# EAGLE design ANIMA Sensor Breakout (EAGLE 5.11)

## Sheet 1 of 2
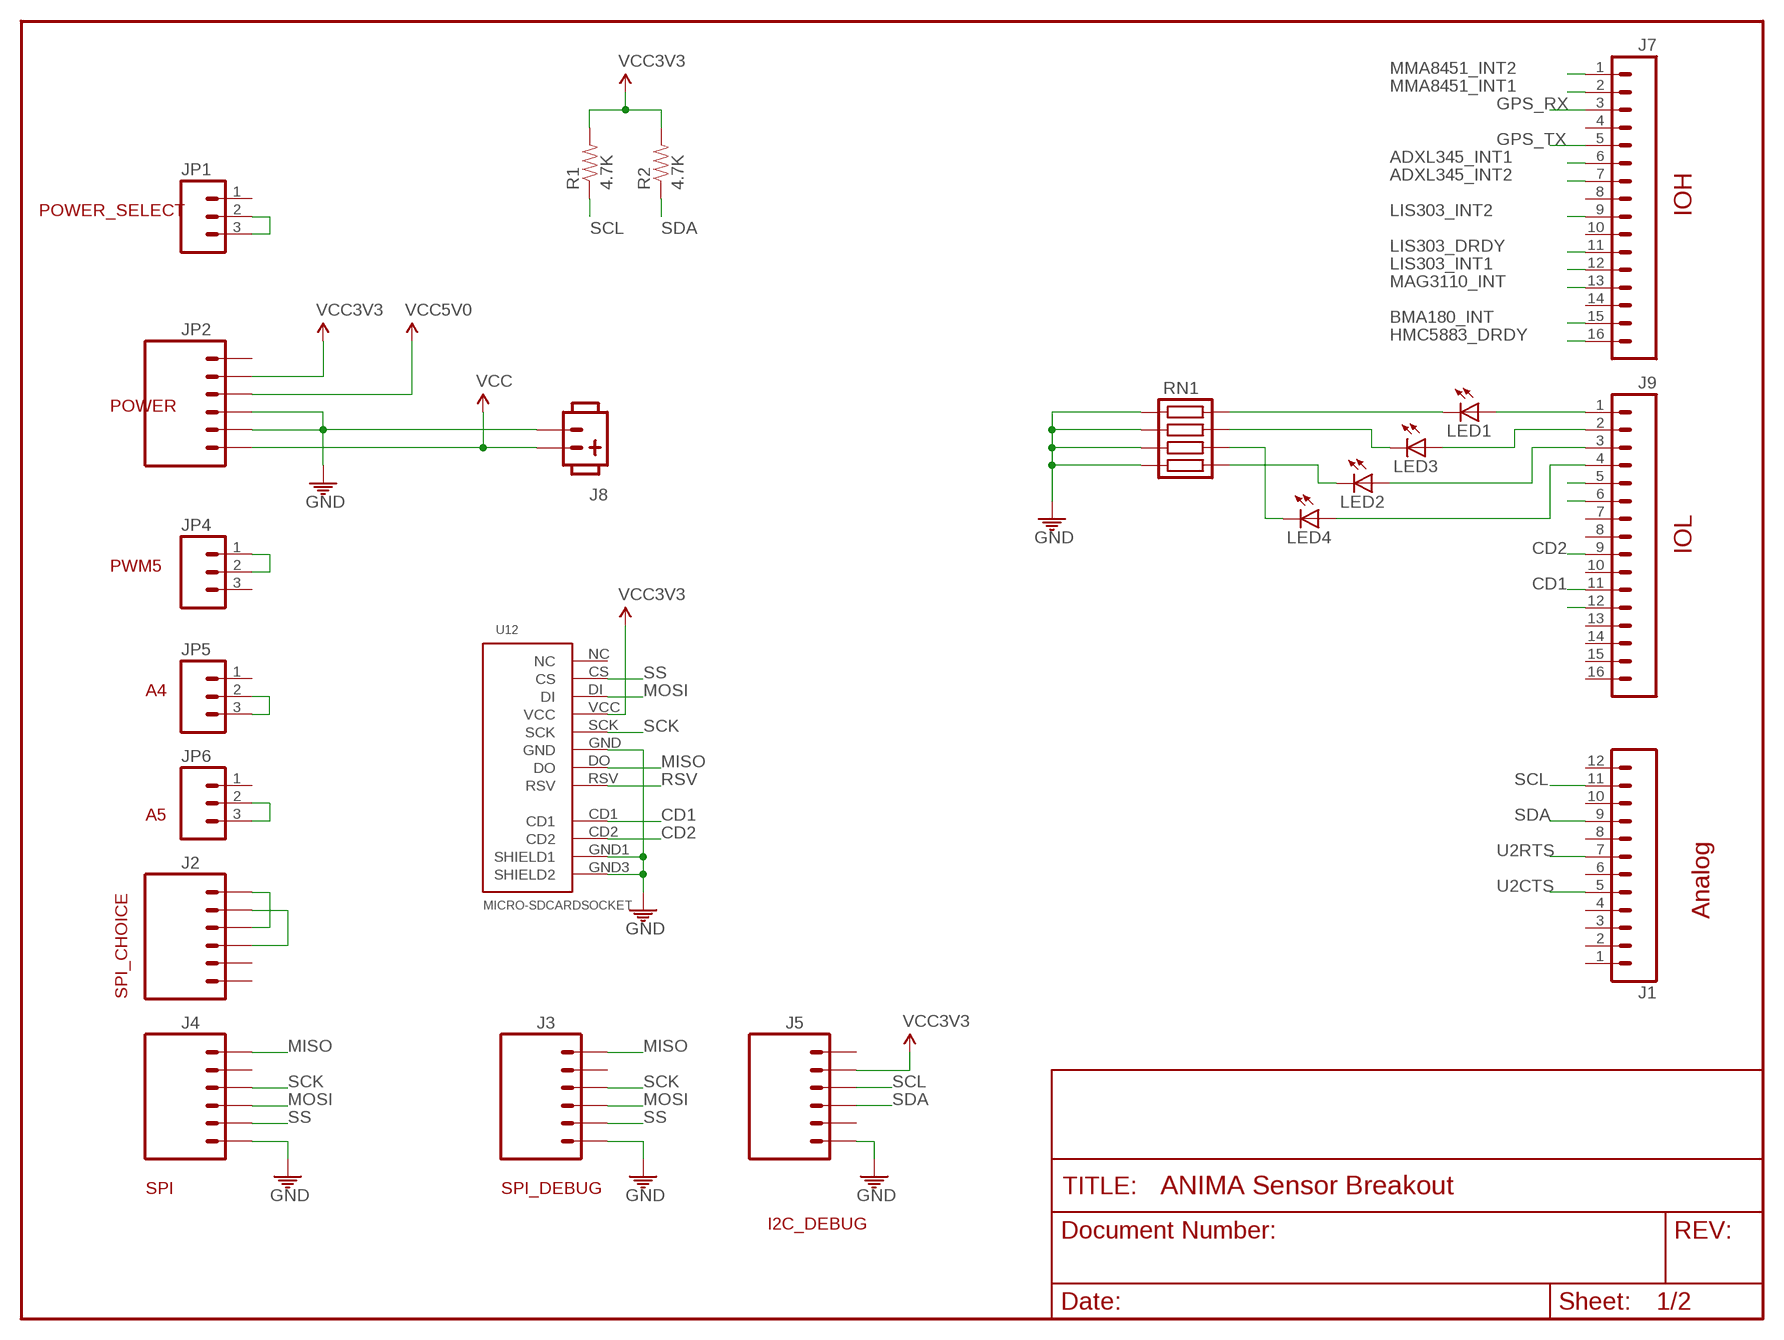
[diagram p0: schematic, sheet 1]

### Parts
J1  M12DUAL_ROW  [2X6]
J2  M06DUAL_ROW  [2X03]
J3  M06LOCK  [1X06_LOCK]
J4  M06DUAL_ROW  [2X03]
J5  M06LOCK  [1X06_LOCK]
J7  IOH  M16DUAL_ROW  [2X8]
J8  POW_CONNECTFEMALE-RA  [SOCKET-FEMALE_RA-3.96MM-2]
J9  IOL  M16DUAL_ROW  [2X8]
JP1  M03PTH  [1X03]
JP2  M06SIP  [1X06]
JP4  M03PTH  [1X03]
JP5  M03PTH  [1X03]
JP6  M03PTH  [1X03]
LED1  LED1206  [LED-1206]
LED2  LED1206  [LED-1206]
LED3  LED1206  [LED-1206]
LED4  LED1206  [LED-1206]
R1  4.7K  RESISTOR0805-RES  [0805]
R2  4.7K  RESISTOR0805-RES  [0805]
RN1  RESISTOR_ARRAY-4  [EXB-38V271JV]
U12  MICRO-SDCARDSOCKET  [MICRO-SD-SOCKET-PP]

### Nets
ADXL345_INT1: J7.6 ; also sheet 2
ADXL345_INT2: J7.7 ; also sheet 2
BMA180_INT: J7.15 ; also sheet 2
CD1: J9.11 U12.CD1
CD2: J9.9 U12.CD2
GND: J3.6 J4.6 J5.6 J8.2 JP2.4 JP2.5 RN1.P$1 RN1.P$2 RN1.P$3 RN1.P$4 U12.GND U12.GND1(SHIELD1) U12.GND3(SHIELD2) ; also sheet 2
GPS_RX: J7.3 ; also sheet 2
GPS_TX: J7.5 ; also sheet 2
HMC5883_DRDY: J7.16 ; also sheet 2
LIS303_DRDY: J7.11 ; also sheet 2
LIS303_INT1: J7.12 ; also sheet 2
LIS303_INT2: J7.9 ; also sheet 2
MAG3110_INT: J7.13 ; also sheet 2
MISO: J3.1 J4.1 U12.DO
MMA8451_INT1: J7.2 ; also sheet 2
MMA8451_INT2: J7.1 ; also sheet 2
MOSI: J3.4 J4.4 U12.DI
N$1: JP5.2 JP5.3
N$4: JP1.2 JP1.3
N$6: J2.1 J2.3
N$7: J2.2 J2.4
N$8: J9.1 LED1.A
N$9: J9.2 LED3.A
N$12: J9.3 LED2.A
N$13: J9.12
N$14: J9.4 LED4.A
N$15: J9.5
N$16: J9.6
N$17: LED4.C RN1.P$6
N$18: LED2.C RN1.P$5
N$20: LED3.C RN1.P$7
N$21: LED1.C RN1.P$8
N$89: JP4.1 JP4.2
N$91: JP6.2 JP6.3
RSV: U12.RSV
SCK: J3.3 J4.3 U12.SCK
SCL: J1.11 J5.3 R1.1 ; also sheet 2
SDA: J1.9 J5.4 R2.1 ; also sheet 2
SS: J3.5 J4.5 U12.CS
U2CTS: J1.5
U2RTS: J1.7
VCC: J8.1 JP2.6 ; also sheet 2
VCC3V3: J5.2 JP2.2 R1.2 R2.2 U12.VCC ; also sheet 2
VCC5V0: JP2.3
Unconnected: J1.1 J1.2 J1.3 J1.4 J1.6 J1.8 J1.10 J1.12 J2.5 J2.6 J3.2 J4.2 J5.1 J5.5 J7.4 J7.8 J7.10 J7.14 J9.7 J9.8 J9.10 J9.13 J9.14 J9.15 J9.16 JP1.1 JP2.1 JP4.3 JP5.1 JP6.1 U12.NC

### Notes on the sheet
- POWER_SELECT | IOH
- POWER
- IOL
- PWM5
- A4
- A5
- Analog
- SPI_CHOICE
- SPI | SPI_DEBUG
- I2C_DEBUG

## Sheet 2 of 2
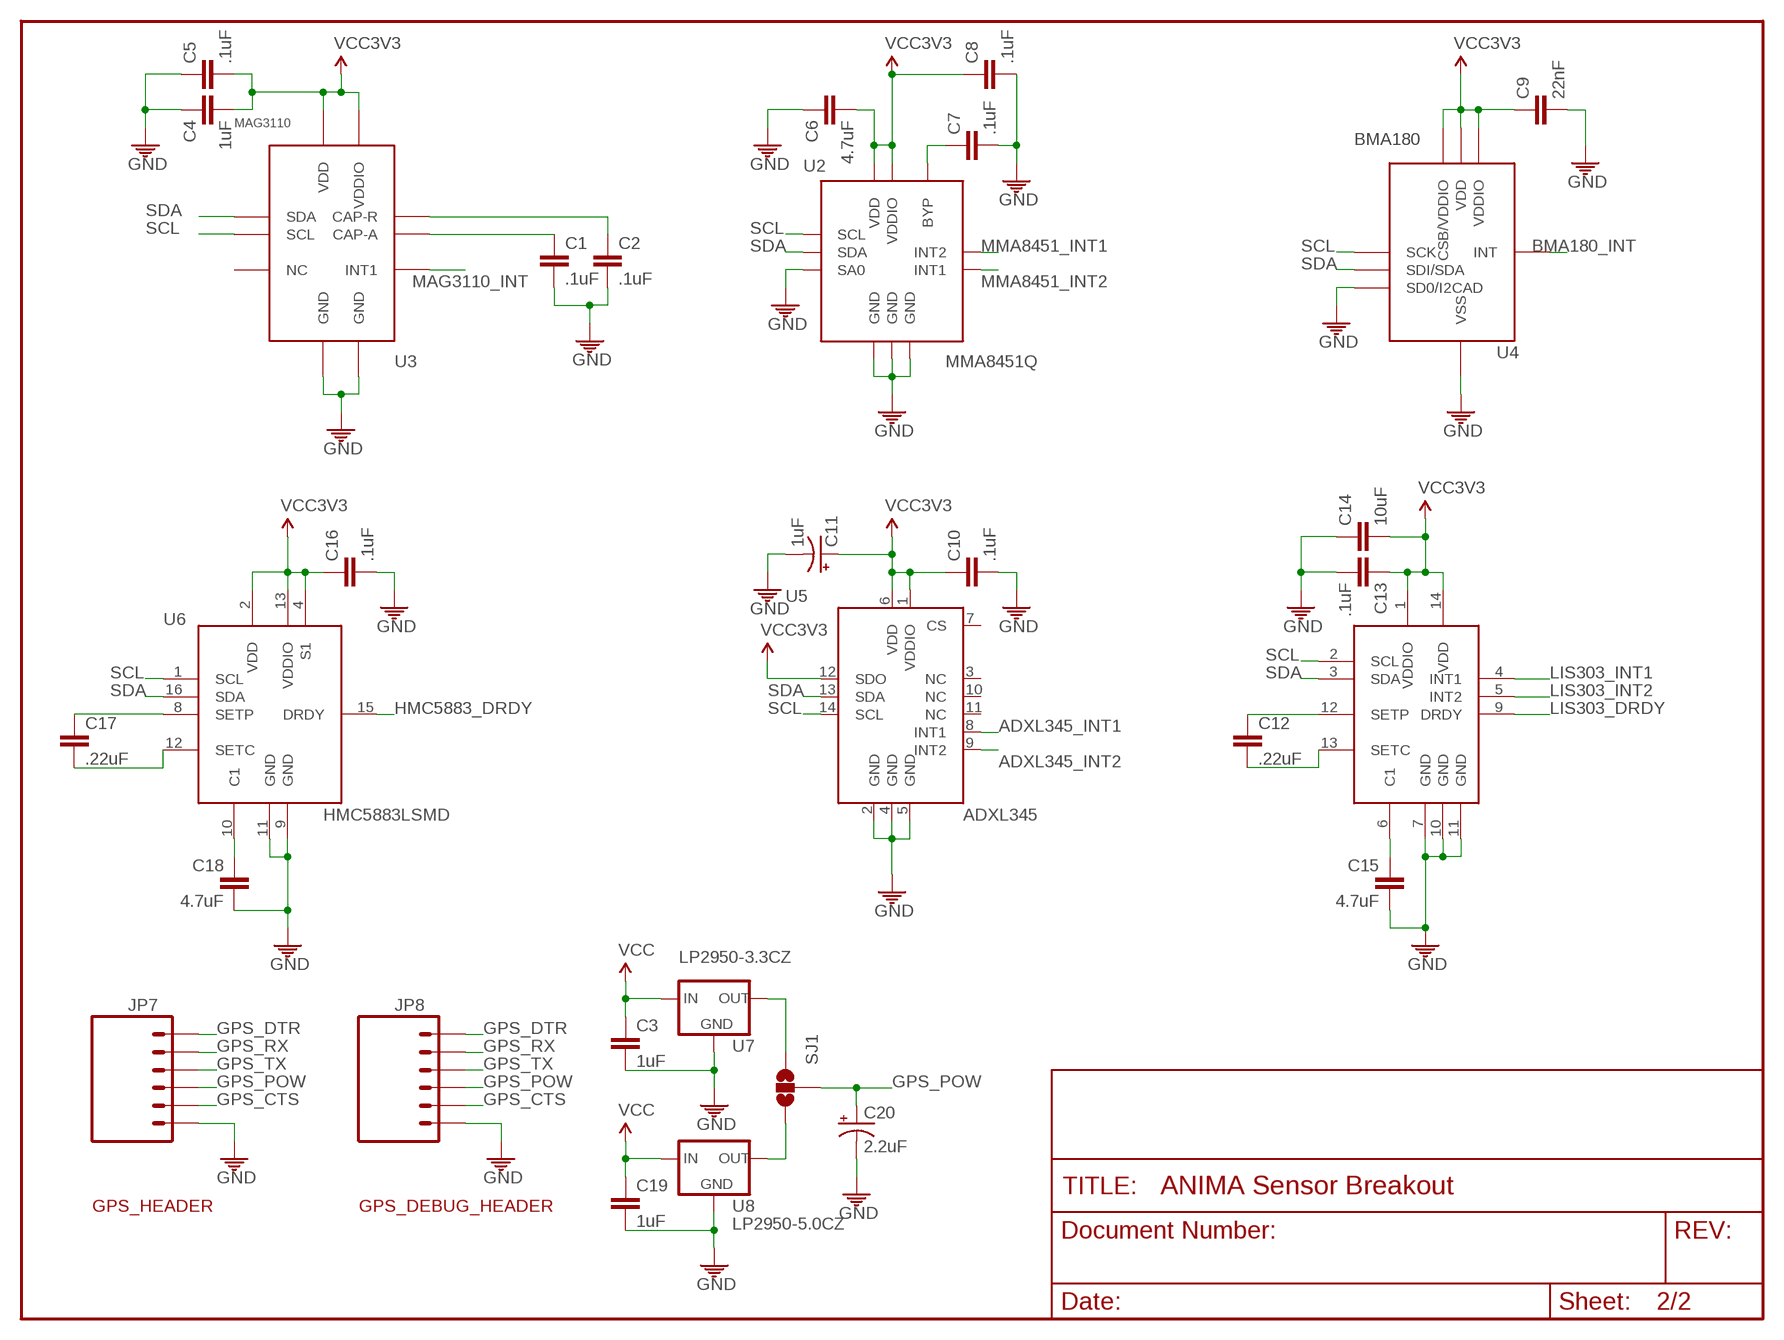
[diagram p1: schematic, sheet 2]

### Parts
C1  .1uF  CAP0805  [0805]
C2  .1uF  CAP0805  [0805]
C3  1uF  CAP0805  [0805]
C4  1uF  CAP0805  [0805]
C5  .1uF  CAP0805  [0805]
C6  4.7uF  CAP0805  [0805]
C7  .1uF  CAP0805  [0805]
C8  .1uF  CAP0805  [0805]
C9  22nF  CAP0805  [0805]
C10  .1uF  CAP0805  [0805]
C11  1uF  CAP_POLRUBY  [RUBYCON_4X5.5]
C12  .22uF  CAP0805  [0805]
C13  .1uF  CAP0805  [0805]
C14  10uF  CAP0805  [0805]
C15  4.7uF  CAP0805  [0805]
C16  .1uF  CAP0805  [0805]
C17  .22uF  CAP0805  [0805]
C18  4.7uF  CAP0805  [0805]
C19  1uF  CAP0805  [0805]
C20  2.2uF  CAP_POLPTH2  [CPOL-RADIAL-10UF-25V]
JP7  M06FEMALE_LOCK  [1X06_FEMALE_LOCK.010]
JP8  M06FEMALE_LOCK  [1X06_FEMALE_LOCK.010]
SJ1  SOLDERJUMPER_2WAYT  [SJ_2]
U1  LSM303DLHC  [LGA14]
U2  MMA8451Q  [QFN-16_FREE]
U3  MAG3110  [DFN-10_FREE]
U4  BMA180  [LGA12_BOSCH]
U5  ADXL345  [LGA14]
U6  HMC5883LSMD  [16LPCC]
U7  LP2950-3.3CZ  [TO92]
U8  LP2950-5.0CZ  [TO92]

### Nets
ADXL345_INT1: U5.8(INT1) ; also sheet 1
ADXL345_INT2: U5.9(INT2) ; also sheet 1
BMA180_INT: U4.4(INT) ; also sheet 1
GND: C1.2 C2.2 C3.2 C4.1 C5.1 C6.1 C7.2 C8.2 C9.2 C10.2 C11.- C13.2 C14.1 C15.2 C16.2 C18.2 C19.2 C20.2(-) JP7.6 JP8.6 U1.7(GND) U1.10(GND) U1.11(GND) U2.P$5(GND) U2.P$7(SA0) U2.P$10(GND) U2.P$12(GND) U3.P$5(GND) U3.P$10(GND) U4.3(VSS) U4.8(SD0/I2CAD) U5.2(GND) U5.4(GND) U5.5(GND) U6.9(GND) U6.11(GND) U7.2(GND) U8.2(GND) ; also sheet 1
GPS_CTS: JP7.5 JP8.5
GPS_DTR: JP7.1 JP8.1
GPS_POW: C20.1(+) JP7.4 JP8.4 SJ1.2
GPS_RX: JP7.2 JP8.2 ; also sheet 1
GPS_TX: JP7.3 JP8.3 ; also sheet 1
HMC5883_DRDY: U6.15(DRDY) ; also sheet 1
LIS303_DRDY: U1.9(DRDY) ; also sheet 1
LIS303_INT1: U1.4(INT1) ; also sheet 1
LIS303_INT2: U1.5(INT2) ; also sheet 1
MAG3110_INT: U3.P$9(INT1) ; also sheet 1
MMA8451_INT1: U2.P$9(INT2) ; also sheet 1
MMA8451_INT2: U2.P$11(INT1) ; also sheet 1
N$2: C2.1 U3.P$4(CAP-R)
N$3: C1.1 U3.P$1(CAP-A)
N$5: C7.1 U2.P$2(BYP)
N$10: C15.1 U1.6(C1)
N$11: C12.2 U1.13(SETC)
N$19: C12.1 U1.12(SETP)
N$23: C17.2 U6.12(SETC)
N$24: C17.1 U6.8(SETP)
N$25: C18.1 U6.10(C1)
N$34: SJ1.1 U8.1(OUT)
N$35: SJ1.3 U7.1(OUT)
SCL: U1.2(SCL) U2.P$4(SCL) U3.P$7(SCL) U4.7(SCK) U5.14(SCL) U6.1(SCL) ; also sheet 1
SDA: U1.3(SDA) U2.P$6(SDA) U3.P$6(SDA) U4.9(SDI/SDA) U5.13(SDA) U6.16(SDA) ; also sheet 1
VCC: C3.1 C19.1 U7.3(IN) U8.3(IN) ; also sheet 1
VCC3V3: C4.2 C5.2 C6.2 C8.1 C9.1 C10.1 C11.+ C13.1 C14.2 C16.1 U1.1(VDDIO) U1.14(VDD) U2.P$1(VDDIO) U2.P$14(VDD) U3.P$2(VDD) U3.P$8(VDDIO) U4.2(VDD) U4.5(CSB/VDDIO) U4.10(VDDIO) U5.1(VDDIO) U5.6(VDD) U5.12(SDO) U6.2(VDD) U6.4(S1) U6.13(VDDIO) ; also sheet 1
Unconnected: U3.P$3(NC) U5.3(NC) U5.7(CS) U5.10(NC) U5.11(NC)

### Notes on the sheet
- GPS_HEADER | GPS_DEBUG_HEADER

## Library data of the parts
C1-C10 C12-C19 = ANIMAlib:CAP: Capacitor Standard 0603 ceramic capacitor, and 0.1" leaded capacitor.
C11 C20 = ANIMAlib:CAP_POL: Capacitor Polarized These are standard SMD and PTH capacitors. Normally 10uF, 47uF, and 100uF in electrolytic and tantalum varieties. Always verify the external diameter of the through hole cap, it varies with capacity, voltage, and manufacturer. The EIA devices should be standard.
J1 = ANIMAlib:M12: Header 12 Standard 12-pin 0.1" header. Use with straight break away headers (SKU : PRT-00116), right angle break away headers (PRT-00553), swiss pins (PRT-00743), machine pins (PRT-00117), and female headers (PRT-00115).
J2-J5 JP2 = CMPE118lib:M06: Header 6 Standard 6-pin 0.1" header. Use with straight break away headers (SKU : PRT-00116), right angle break away headers (PRT-00553), swiss pins (PRT-00743), machine pins (PRT-00117), and female headers (PRT-00115). Molex polarized connector foot print use with SKU : PRT-08094 with associated crimp pins and housings. NOTES ON THE VARIANTS LOCK and LOCK_LONGPADS... This footprint was designed to help hold the alignment of a through-hole component (i.e. 6-pin header) while soldering it into place. You may notice that each hole has been shifted either up or down by 0.005 of an inch from it's more standard position (which is a perfectly straight line). This slight alteration caused the pins (the squares in the middle) to touch the edges of the holes. Because they are alternating, it causes a "brace" to hold the component in place. 0.005 has proven to be the perfect amount of "off-center" position when using our standard breakaway headers. Although looks a little odd when you look at the bare footprint, once you have a header in there, the alteration is very hard to notice. Also, if you push a header all the way into place, it is covered up entirely on the bottom side. This idea of altering the position of holes to aid alignment will be further integrated into the Sparkfun Library for other footprints. It can help hold any component with 3 or more connection pins.
J7 J9 = CMPE118lib:M16: Header 16 Standard 16-pin 0.1" header. Male version: taken from http://search.digikey.com/scripts/DkSearch/dksus.dll?Detail&name=SAM1034-50-ND Female Version:
J8 = ANIMAlib:POW_CONNECT
JP1 JP4-JP6 = CMPE118lib:M03: Header 3 Standard 3-pin 0.1" header. Use with straight break away headers (SKU : PRT-00116), right angle break away headers (PRT-00553), swiss pins (PRT-00743), machine pins (PRT-00117), and female headers (PRT-00115). Molex polarized connector foot print use with SKU : PRT-08232 with associated crimp pins and housings.
JP7 JP8 = ANIMAlib:M06: Header 6 Standard 6-pin 0.1" header. Use with straight break away headers (SKU : PRT-00116), right angle break away headers (PRT-00553), swiss pins (PRT-00743), machine pins (PRT-00117), and female headers (PRT-00115). Molex polarized connector foot print use with SKU : PRT-08094 with associated crimp pins and housings. NOTES ON THE VARIANTS LOCK and LOCK_LONGPADS... This footprint was designed to help hold the alignment of a through-hole component (i.e. 6-pin header) while soldering it into place. You may notice that each hole has been shifted either up or down by 0.005 of an inch from it's more standard position (which is a perfectly straight line). This slight alteration caused the pins (the squares in the middle) to touch the edges of the holes. Because they are alternating, it causes a "brace" to hold the component in place. 0.005 has proven to be the perfect amount of "off-center" position when using our standard breakaway headers. Although looks a little odd when you look at the bare footprint, once you have a header in there, the alteration is very hard to notice. Also, if you push a header all the way into place, it is covered up entirely on the bottom side. This idea of altering the position of holes to aid alignment will be further integrated into the Sparkfun Library for other footprints. It can help hold any component with 3 or more connection pins.
LED1-LED4 = ANIMAlib:LED: LEDs Standard schematic elements and footprints for 5mm, 3mm, 1206, and 0603 sized LEDs. 5mm - Spark Fun Electronics SKU : COM-00529 (and others)
R1 R2 = CMPE118lib:RESISTOR: Resistor Basic schematic elements and footprints for 0603, 1206, and PTH resistors.
RN1 = ANIMAlib:RESISTOR_ARRAY-4: Chip Resistor Array 4 Single Resistor Source: http://industrial.panasonic.com/www-data/pdf/AOC0000/AOC0000PE2.pdf; OC_FARNELL: unknown; OC_NEWARK: unknown
SJ1 = ANIMAlib:SOLDERJUMPER_2WAY: Solder Jumper 2 way solder jumper
U1 = ANIMAlib:LSM303DLHC
U2 = ANIMAlib:MMA8451Q
U3 = ANIMAlib:MAG3110
U4 = ANIMAlib:BMA180
U5 = ANIMAlib:ADXL345
U6 = ANIMAlib:HMC5883L: 3 Axis Digital Compass IC
U7 U8 = ANIMAlib:LP2950: Source: http://cache.national.com/ds/LP/LP2950.pdf
U12 = ANIMAlib:MICRO-SDCARD

## Board
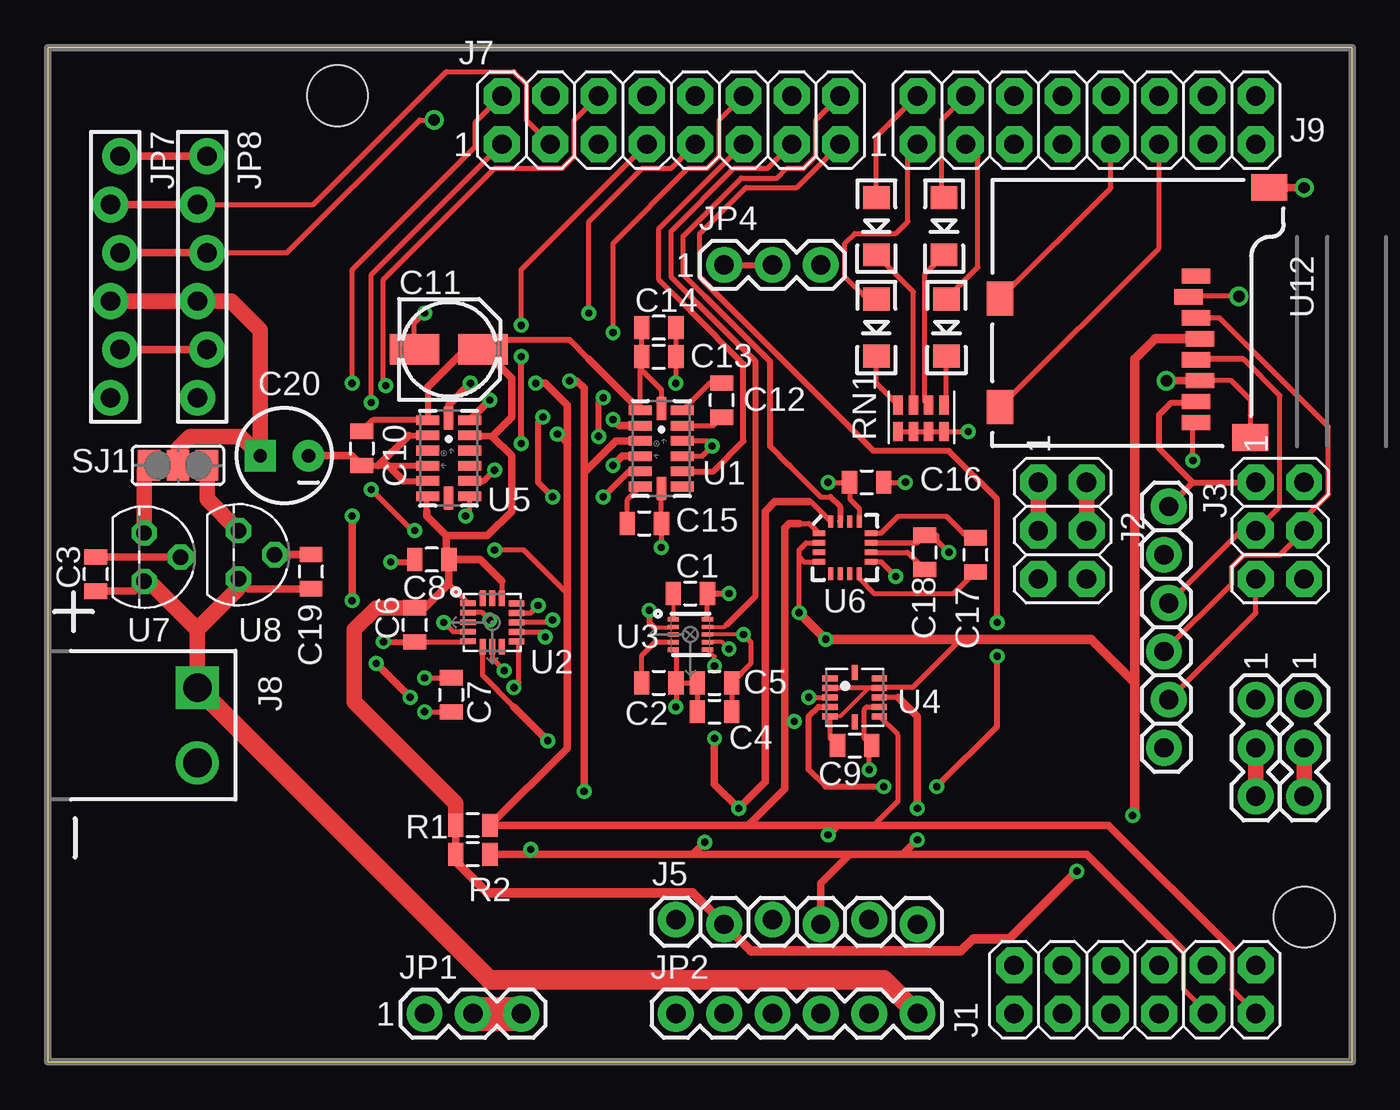
[diagram p2: board, top side]
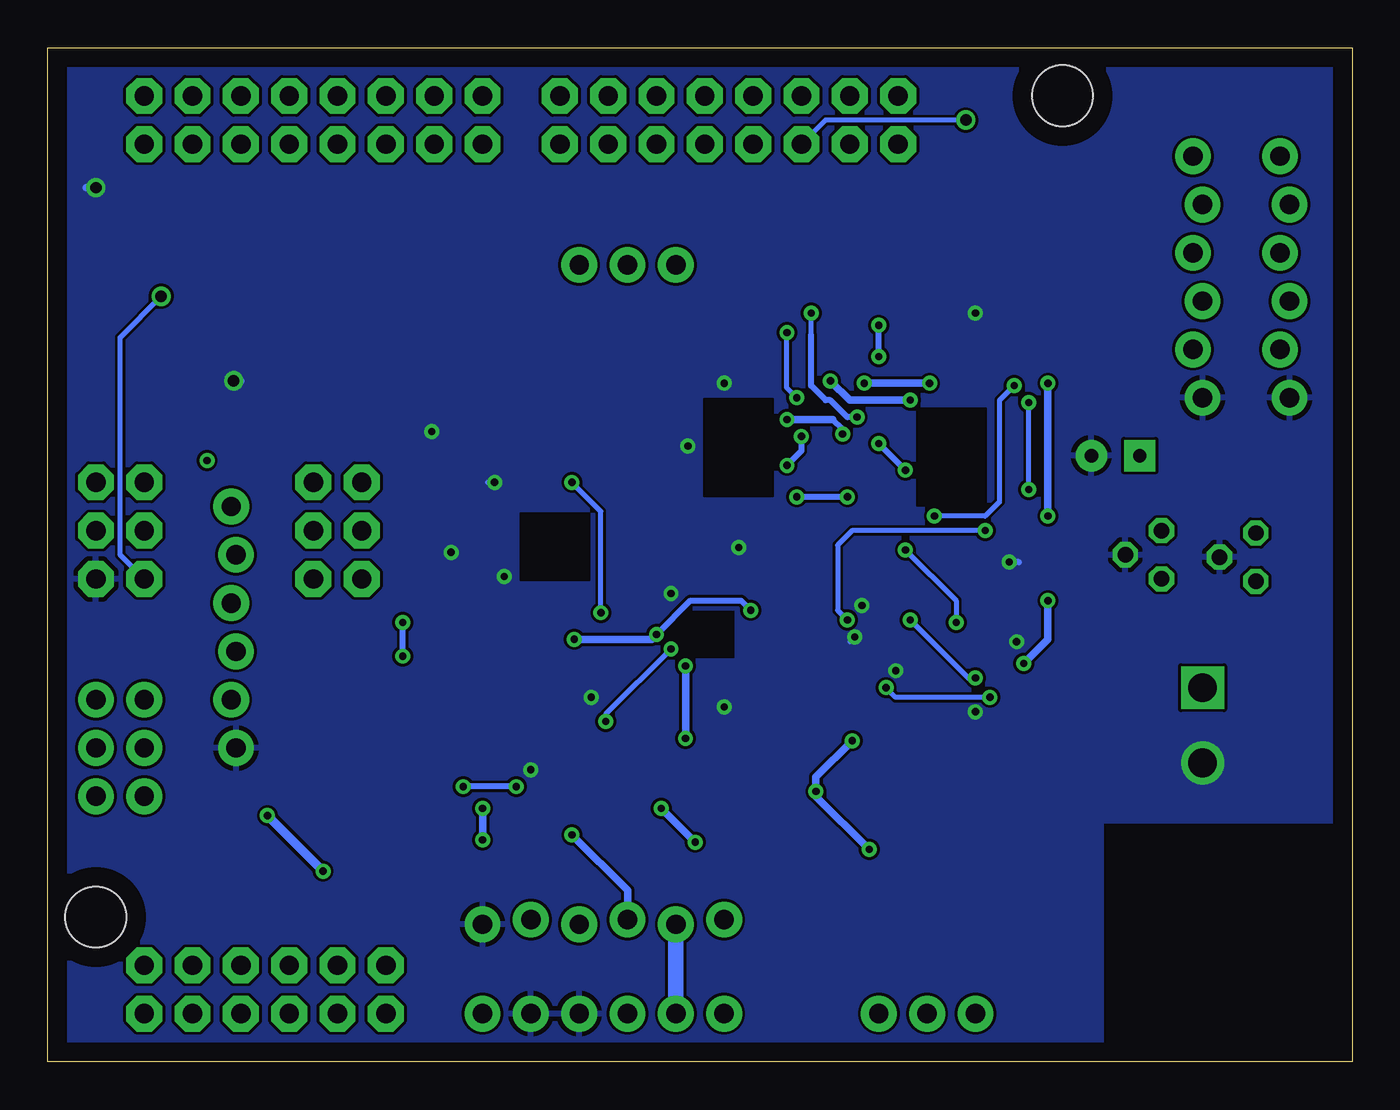
[diagram p3: board, bottom side, seen from below]

Size 68.58 x 53.34 mm. Coordinates in mm from the lower left corner, seen from the top.
Outline: 68.58,0 68.58,53.34 0,53.34 0,0 68.58,0
Copper layers (1*16): Top 0.035mm / dielectric 1.5mm / Bottom 0.035mm
Design rules "default *": minimum track width 8mil, minimum drill 15mil, track to track 6mil, track to pad 6mil, pad to pad 6mil, via to via 6mil, smd to smd 6mil, copper to edge 40mil, drill to drill 8mil, minimum pad ring 10mil, minimum via ring 8mil, stop-mask expansion 4mil, vias tented up to drill 0mil, thermal gap 10mil
Holes 3.2 mm at 15.24,50.8 66.04,7.62

### Footprints (pad centres in the part's own frame; a part is rotated, then mirrored left to right if it is on the bottom)
0805 = smd 0.8 x 1.2: 1 -0.9,0; 2 0.9,0
RUBYCON_4X5.5 = smd 2.6 x 1.6: + 1.8,0; - -1.8,0
CPOL-RADIAL-10UF-25V = drill 0.7 pad 1.651 square: 1 1.27,0 | drill 0.7 pad 1.651 round: 2 -1.27,0
2X6 = drill 1.016 pad 1.88 octagon: 1 -6.35,-1.27; 2 -6.35,1.27; 3 -3.81,-1.27; 4 -3.81,1.27; 5 -1.27,-1.27; 6 -1.27,1.27; 7 1.27,-1.27; 8 1.27,1.27; 9 3.81,-1.27; 10 3.81,1.27; 11 6.35,-1.27; 12 6.35,1.27
2X03 = drill 1.016 pad 1.88 octagon: 1 -2.54,-1.27; 2 -2.54,1.27; 3 0,-1.27; 4 0,1.27; 5 2.54,-1.27; 6 2.54,1.27
1X06_LOCK = drill 1.016 pad 1.88 round: 1 0,0; 2 2.54,-0.254; 3 5.08,0; 4 7.62,-0.254; 5 10.16,0; 6 12.7,-0.254
2X8 = drill 1.016 pad 1.88 octagon: 1 -8.89,-1.27; 2 -8.89,1.27; 3 -6.35,-1.27; 4 -6.35,1.27; 5 -3.81,-1.27; 6 -3.81,1.27; 7 -1.27,-1.27; 8 -1.27,1.27; 9 1.27,-1.27; 10 1.27,1.27; 11 3.81,-1.27; 12 3.81,1.27; 13 6.35,-1.27; 14 6.35,1.27; 15 8.89,-1.27; 16 8.89,1.27
SOCKET-FEMALE_RA-3.96MM-2 = drill 1.5 square: 1 0,0 | drill 1.5 round: 2 3.96,0
1X03 = drill 1.016 pad 1.88 round: 1 -2.54,0; 2 0,0; 3 2.54,0
1X06 = drill 1.016 pad 1.88 round: 1 -6.35,0; 2 -3.81,0; 3 -1.27,0; 4 1.27,0; 5 3.81,0; 6 6.35,0
1X06_FEMALE_LOCK.010 = drill 1.016 pad 1.88 round: 1 0,0.254; 2 2.54,-0.254; 3 5.08,0.254; 4 7.62,-0.254; 5 10.16,0.254; 6 12.7,-0.254
LED-1206 = smd 1.2 x 1.4: A -1.5,0; C 1.5,0
EXB-38V271JV = smd 0.5 x 1: P$1 0,0; P$2 0.8,0; P$3 1.6,0; P$4 2.4,0; P$5 2.4,1.4; P$6 1.6,1.4; P$7 0.8,1.4; P$8 0,1.4
SJ_2 = smd 1.168 x 1.6: 1 -1.524,0; 2 0,0; 3 1.524,0
LGA14 = smd 0.5 x 1.2: 1 2,1.1; 2 1.2,1.1; 3 0.4,1.1; 4 -0.4,1.1; 5 -1.2,1.1; 6 -2,1.1; 8 -2,-1.1; 9 -1.2,-1.1; 10 -0.4,-1.1; 11 0.4,-1.1; 12 1.2,-1.1; 13 2,-1.1 | smd 1.2 x 0.5: 7 -2.1,0; 14 2.1,0
QFN-16_FREE = smd 0.8 x 0.3: P$1 -1.275,1.01; P$2 -1.275,0.51; P$3 -1.275,0.01; P$4 -1.275,-0.49; P$5 -1.275,-0.99; P$9 1.275,-1; P$10 1.275,-0.5; P$11 1.275,0; P$12 1.275,0.5; P$13 1.275,1 | smd 0.3 x 0.8: P$6 -0.5,-1.275; P$7 0,-1.275; P$8 0.5,-1.275; P$14 0.5,1.275; P$15 0,1.275; P$16 -0.5,1.275
DFN-10_FREE = smd 0.6 x 0.225: P$1 -0.9,0.8; P$2 -0.9,0.4; P$3 -0.9,0; P$4 -0.9,-0.4; P$5 -0.9,-0.8; P$6 0.9,-0.8; P$7 0.9,-0.4; P$8 0.9,0; P$9 0.9,0.4; P$10 0.9,0.8
LGA12_BOSCH = smd 0.8 x 0.32: 1 -1.3,1; 2 -1.3,0.5; 3 -1.3,0; 4 -1.3,-0.5; 5 -1.3,-1; 7 1.3,-1; 8 1.3,-0.5; 9 1.3,0; 10 1.3,0.5; 11 1.3,1 | smd 0.32 x 0.8: 6 0,-1.3; 12 0,1.3
16LPCC = smd 0.65 x 0.28: 1 -1.37,0.75; 2 -1.37,0.25; 3 -1.37,-0.25; 4 -1.37,-0.75; 9 1.37,-0.75; 10 1.37,-0.25; 11 1.37,0.25; 12 1.37,0.75 | smd 0.28 x 0.65: 5 -0.75,-1.37; 6 -0.25,-1.37; 7 0.25,-1.37; 8 0.75,-1.37; 13 0.75,1.37; 14 0.25,1.37; 15 -0.25,1.37; 16 -0.75,1.37
TO92 = drill 0.813 octagon: 1 -1.27,0; 2 0,1.905; 3 1.27,0
MICRO-SD-SOCKET-PP = smd 1.8 x 1.4: CD1 -2.05,0.4; CD2 -7.75,0.4 | smd 0.8 x 1.5: CS -7.84,10.3; DI -6.74,10.7; DO -2.34,10.7; GND -3.44,10.9; NC -8.94,10.7; RSV -1.24,10.7; SCK -4.54,10.7; VCC -5.64,10.9 | smd 1.4 x 1.9: GND1 -13.6,14.55; GND3 -0.45,13.55

### Placement (x,y rotation side)
C1  33.78,24.64 0 top
C2  32.13,19.94 0 top
C3  2.54,25.65 90 top
C4  35.05,18.41 0 top
C5  35.05,19.94 0 top
C6  19.3,22.99 90 top
C7  21.21,19.3 270 top
C8  20.19,26.42 180 top
C9  42.42,16.64 0 top
C10  16.51,32.26 270 top
C11  21.08,37.47 0 top
C12  35.43,34.8 90 top
C13  32.13,37.08 0 top
C14  32.13,38.61 180 top
C15  31.37,28.32 0 top
C16  43.05,30.48 0 top
C17  48.77,26.67 90 top
C18  46.1,26.8 90 top
C19  13.84,25.78 90 top
C20  12.45,31.88 180 top
J1  57.15,3.81 0 top
J2  53.34,27.94 270 top
J3  58.93,29.21 270 top
J4  64.77,27.94 270 top
J5  33.02,7.49 0 top
J7  32.77,49.53 0 top
J8  7.87,19.68 270 top
J9  54.61,49.53 0 top
JP1  22.35,2.54 0 top
JP2  39.37,2.54 0 top
JP4  38.1,41.91 0 top
JP5  63.5,16.51 270 top
JP6  66.04,16.51 270 top
JP7  3.56,47.62 270 top
JP8  8.13,47.62 270 top
LED1  43.56,38.61 270 top
LED2  47.24,38.61 270 top
LED3  43.56,43.94 270 top
LED4  47.12,43.94 270 top
R1  22.35,12.45 180 top
R2  22.35,10.92 180 top
RN1  44.7,33.15 0 top
SJ1  6.86,31.37 180 top
U1  32.26,32.26 90 top
U2  23.37,23.11 0 top
U3  33.78,22.48 0 top
U4  42.42,19.18 0 top
U5  21.08,31.75 90 top
U6  41.91,27.05 0 top
U7  5.08,26.54 270 top
U8  10.03,26.67 270 top
U12  49.66,32.38 270 top

### Tracks (layer width: path | path; a pad name or v marks a point on that pad's centre or on a via)
ADXL345_INT1  (via drill 0.38)
  Top 0.254: U5.8 22.18,28.91 v21.97,28.7 | v17.78,35.56 17.65,35.69 17.65,41.15 23.5,46.99 27.05,46.99 27.69,47.62 27.69,49.53 J7.6
  Bottom 0.254: v21.97,28.7 19.3,28.7 18.54,29.46 18.54,34.8 v17.78,35.56
ADXL345_INT2  (via drill 0.38)
  Top 0.254: v24.89,38.73 24.89,41.66 J7.7
  Top 0.305: U5.9 22.93,30.55 v23.5,31.11 | v24.89,32.51 v24.89,37.08
  Bottom 0.305: v23.5,31.11 v24.89,32.51 | v24.89,37.08 v24.89,38.73
BMA180_INT  (via drill 0.38)
  Top 0.254: 34.42,41.15 34.29,41.27 34.29,43.56 36.7,45.97 39.37,45.97 J7.15
  Top 0.305: U4.4 40.52,18.68 40.01,18.16 40.01,15.37 40.89,14.48 v43.94,14.48 | v46.74,14.48 49.91,17.65 v49.91,21.34 | v49.91,23.11 49.91,29.59 47.37,32.13 43.43,32.13 34.42,41.15
  Bottom 0.305: v43.94,14.48 v46.74,14.48 | v49.91,21.34 v49.91,23.11
CD1
  Top 0.254: U12.CD1 58.42,42.8 J9.11
CD2
  Top 0.254: U12.CD2 55.88,45.96 J9.9
GND  (via drill 0.38, 0.6)
  Top 0.203: U3.P$5 33.03,21.53
  Top 0.254: U12.GND 62.22,35.83 63.25,34.8 63.25,32.87 U12.GND3 | C6.1 22.06,22.09 U2.P$5 | C7.2 19.82,18.4 v19.81,18.41 | U2.P$10 25.91,22.61 v26.16,22.35 | C14.1 C13.2 v33.02,35.69 | U1.7 32.26,28.33 C15.2 32.27,27.06 v32.26,27.05 | U1.10 34.4,31.86 v34.92,32.38 34.65,32.66 U1.11 | C18.2 45.7,27.3 U6.11 45.72,27.3 | 45.72,27.3 46.1,27.69 | 46.1,27.69 46.74,27.69 46.74,27.43 v47.37,26.8 | U6.9 43.8,26.3 v44.58,25.53 | 45.72,27.3 45.72,27.43 45.97,27.69 46.1,27.69 | U3.P$10 C1.2 | 33.03,21.53 C2.2 | C2.2 C5.1 C4.1 | C2.2 v33.03,18.68 v33.02,18.67 | 42.93,17.03 C9.2 | 42.93,17.03 42.93,18.54 43.06,18.68 U4.8 | v40.01,19.18 U4.3 | U2.P$7 23.37,21.21 v24,20.57 | 42.93,17.03 42.93,17.02 43.18,16.76 v43.18,15.37 | U2.P$12 24.65,23.62 25.4,23.62 v25.78,24 | C11.- 19.28,38.84 v19.81,39.37 | RN1.P$1 RN1.P$2 RN1.P$3 RN1.P$4 v48.39,33.15 | C16.2 v45.09,30.48
  Top 0.305: U5.4 17.91,31.36 17.39,31.36 C10.2 | 18.71,30.55 U5.5 | 18.98,32.95 U5.2 | C8.2 19.17,26.29 v18.03,26.29 | C6.1 v17.65,22.1 | C1.2 v35.81,24.64
  Top 0.406: U12.GND1 66.04,45.98 v66.04,45.97 | U12.GND 58.8,35.83 v58.8,35.81 | C19.2 11.95,26.68 U8.2 | C3.2 6.97,26.55 U7.2 | C10.2 15.99,31.88 C20.2 | 17.91,31.36 18.71,30.55 | 17.39,31.36 18.98,32.95
  Bottom 0.254: v19.81,18.41 19.56,18.41 | v26.16,22.35 26.42,22.1 | v32.26,27.05 32.26,26.92 | v33.02,35.69 33.02,35.56 | v34.92,32.38 34.92,32.51 | 44.58,25.27 v44.58,25.53 | v47.37,26.8 47.37,26.54 | v35.81,24.64 35.94,24.64 | v33.02,18.67 33.02,18.41 | v40.01,19.18 39.75,19.18 | v24,20.57 24.13,20.45 | 43.18,15.11 v43.18,15.37 | v25.78,24 25.91,24.13 | v19.81,39.37 19.94,39.5 | v48.39,33.15 48.51,33.15 | v45.09,30.48 45.47,30.48
  Bottom 0.305: 17.53,26.29 v18.03,26.29 | v17.65,22.1 17.4,22.1
  Bottom 0.406: v66.04,45.97 66.55,45.97 | v58.8,35.81 58.42,35.81
  pour Bottom: 68.58,0 13.21,0 13.21,12.7 0,12.7 0,53.34 68.58,53.34
GPS_CTS
  Top 0.406: JP7.5 JP8.5
GPS_DTR
  Top 0.406: JP7.1 JP8.1
GPS_POW
  Top 0.813: JP7.4 JP8.4 9.65,40.01 11.18,38.48 C20.1 10.16,32.89 7.49,32.89 6.86,32.26 SJ1.2
GPS_RX
  Top 0.254: JP8.2 13.97,45.09 20.95,52.07 24.51,52.07 25.15,51.44 25.15,49.53 J7.3
  Top 0.406: JP7.2 JP8.2
GPS_TX  (via drill 0.6)
  Top 0.254: v20.32,49.53 19.56,49.53 12.57,42.55 JP8.3
  Top 0.406: JP7.3 JP8.3
  Bottom 0.254: J7.5 27.69,49.53 v20.32,49.53
HMC5883_DRDY
  Top 0.254: 34.54,40.26 33.4,41.4 33.4,43.43 36.45,46.48 38.35,46.48 38.86,46.99 39.75,46.99 40.39,47.62 40.39,49.53 J7.16 | 41.15,29.72 40.64,29.72 38.99,31.37
  Top 0.305: 38.99,31.37 37.97,32.38 37.97,36.83 34.54,40.26 | U6.15 41.66,29.21 41.15,29.72
LIS303_DRDY
  Top 0.254: 33.78,39.5 32.13,41.15 32.13,43.81 J7.11
  Top 0.305: U1.9 34.99,31.06 36.58,32.64 36.58,36.7 33.78,39.5
LIS303_INT1  (via drill 0.38)
  Top 0.254: v29.72,38.35 29.72,43.05 33.66,46.99 34.67,46.99 35.31,47.62 35.31,49.53 J7.12
  Top 0.305: v28.96,32.89 28.96,34.67 v29.21,34.92
  Top 0.406: U1.4 30.21,31.86 v29.72,31.37
  Bottom 0.254: v29.21,34.92 29.72,35.43 v29.72,38.35
  Bottom 0.305: v29.72,31.37 28.96,32.13 v28.96,32.89
LIS303_INT2  (via drill 0.38)
  Top 0.254: v28.45,39.37 28.45,44.2 31.24,46.99 32.77,46.99 J7.9
  Top 0.305: v26.54,29.72 25.78,30.48 25.78,33.66 v26.04,33.91 | U1.5 30.55,31.06 v29.21,29.72
  Bottom 0.254: 28.45,38.23 v28.45,39.37
  Bottom 0.305: v26.54,29.72 v29.21,29.72 | 28.45,38.23 28.45,35.56 27.69,34.8 27.43,34.8 26.54,33.91 v26.04,33.91
MAG3110_INT
  Top 0.203: U3.P$9 35.58,22.88 35.69,22.99
  Top 0.254: J7.13 37.85,46.99 36.07,46.99 32.77,43.69 32.77,41.27 34.16,39.88
  Top 0.305: 35.69,22.99 37.21,24.51 37.21,36.83 34.16,39.88
MISO
  Top 0.305: J3.1 60.2,30.48 | 60.2,30.48 J4.1 | 60.2,30.48 58.42,32.26 58.42,34.04 59.05,34.67 60.3,34.67
  Top 0.406: 60.3,34.67 U12.DO
MMA8451_INT1  (via drill 0.38)
  Top 0.254: v16,35.69 16,41.66 21.34,46.99 22.48,48.13 22.48,49.4 J7.2 | U2.P$9 24.77,21.99 24.77,19.94 v24.51,19.68
  Top 0.406: v17.27,20.95 v19.05,19.18 | v16,24.26 v16,28.7
  Bottom 0.254: v24.51,19.68 24,19.18 v19.05,19.18
  Bottom 0.406: v17.27,20.95 16,22.23 v16,24.26 | v16,28.7 v16,35.69
MMA8451_INT2  (via drill 0.38)
  Top 0.254: U2.P$11 26.42,23.11 v26.54,23.24 | v17.02,34.67 17.02,41.4 22.48,46.86 J7.1 | v19.3,27.94 19.18,27.94 v17.02,30.1
  Bottom 0.254: v26.54,23.24 27.05,23.75 27.05,27.18 26.29,27.94 v19.3,27.94 | v17.02,30.1 v17.02,34.67
MOSI
  Top 0.254: U12.DI 61.59,39.12 67.31,33.4 67.31,29.84 66.04,28.57 J4.4 64.77,26.67 62.87,26.67 62.23,26.04 62.23,25.15 J3.4
N$1
  Top 0.813: JP5.3 JP5.2
N$2
  Top 0.254: U3.P$4 31.93,22.07 31.23,21.38 C2.1
N$3
  Top 0.203: C1.1 U3.P$1
N$4
  Top 1.778: JP1.2 JP1.3
N$5  (via drill 0.38)
  Top 0.254: v23.24,23.24 22.86,23.62 U2.P$2 | C7.1 21.2,20.19 v19.81,20.19
  Bottom 0.254: v19.81,20.19 20.19,20.19 v23.24,23.24
N$6
  Top 0.813: J2.3 J2.1
N$7
  Top 0.813: J2.4 J2.2
N$8
  Top 0.254: J9.1 45.21,47.75 45.21,44.2 44.58,43.56 42.42,43.56 41.91,43.05 41.91,41.27 43.08,40.11 LED1.A
N$9
  Top 0.254: J9.2 43.56,48.64 LED3.A
N$10
  Top 0.254: C15.1 30.47,29.57 U1.6
N$11
  Top 0.254: U1.13 34.8,35.7 C12.2
N$12
  Top 0.254: J9.3 48.9,47.62 48.9,41.78 47.24,40.13 LED2.A
N$14
  Top 0.254: J9.4 46.99,49.53 46.99,45.57 LED4.A
N$17
  Top 0.254: LED4.C 46.1,41.43 46.1,34.75 RN1.P$6
N$18
  Top 0.254: LED2.C 47.24,34.69 RN1.P$5
N$19
  Top 0.254: C12.1 34.99,33.46 U1.12
N$20
  Top 0.254: LED3.C 45.5,40.5 RN1.P$7
N$21
  Top 0.254: LED1.C 43.56,35.69 RN1.P$8
N$23
  Top 0.254: C17.2 48.76,27.56 48.39,27.56 47.24,28.7 44.7,28.7 43.8,27.8 U6.12
N$24
  Top 0.254: C17.1 47.64,24.64 43.43,24.64 42.66,25.41 U6.8
N$25
  Top 0.254: C18.1 45.2,26.8 U6.10
N$34
  Top 0.813: U8.1 8.38,29.59 SJ1.1
N$35
  Top 0.813: U7.1 5.08,31.11 SJ1.3
N$89
  Top 0.305: JP4.1 JP4.2
N$91
  Top 0.813: JP6.3 JP6.2
RSV  (via drill 0.38)
  Top 0.254: v60.2,31.62 60.2,33.53 60.3,33.62 U12.RSV
SCK
  Top 0.254: 62.87,36.96 64.77,35.05 64.77,29.21 J4.3 62.74,27.94 J3.3
  Top 0.305: 62.87,36.96 60.39,36.96
  Top 0.406: 60.39,36.96 U12.SCK
SCL  (via drill 0.38)
  Top 0.203: U3.P$7 35.45,22.08 v35.81,21.72
  Top 0.254: J1.11 62.23,3.81 62.23,5.97 | U2.P$4 21.32,22.62 v20.83,23.11 | v23.5,26.92 25.02,26.92 27.3,24.64 | U4.7 44.7,17.19 44.7,13.72 43.43,12.45 43.31,12.45 | U6.1 40.02,28.32 39.5,28.32 | 36.45,12.45 36.83,12.45 | v39.24,17.91 39.12,17.78 38.73,17.78
  Top 0.305: v26.8,33.02 27.18,32.64 27.3,32.64
  Top 0.406: 41.53,12.45 36.45,12.45 R1.1 27.3,16.5 27.3,24.64 27.3,32.64 27.3,34.54 26.16,35.69 v25.65,35.69 | U5.14 21.08,34.54 v22.23,35.69 | U1.2 30.04,33.46 v29.72,33.78 | 41.53,12.45 v41.02,11.94 | 41.53,12.45 43.31,12.45 55.75,12.45 62.23,5.97 | 36.83,12.45 38.73,14.35 38.73,17.78 38.73,28.07 38.99,28.32 39.5,28.32
  Bottom 0.254: v20.83,23.11 20.83,24.26 v23.5,26.92 | v35.81,21.72 39.24,18.29 v39.24,17.91
  Bottom 0.305: v26.8,33.02 26.8,33.27 27.3,33.78
  Bottom 0.406: v25.65,35.69 v22.23,35.69 | 27.3,33.78 v29.72,33.78 | J5.3 38.1,9.02 v41.02,11.94
SDA  (via drill 0.38)
  Top 0.203: 35.05,21.31 U3.P$6
  Top 0.254: J1.9 59.69,3.81 59.69,5.84 | 44.7,19.18 U4.9 | 44.2,10.92 44.96,10.92 | U6.16 40.12,29.46 40.01,29.46 | v35.05,20.83 35.05,21.31 | 24.51,18.67 22.87,20.31 U2.P$6
  Top 0.406: 25.15,10.92 33.91,10.92 | 33.91,10.92 42.16,10.92 | 42.16,10.92 44.2,10.92 54.61,10.92 59.69,5.84 | R2.1 25.15,10.92 | 25.15,10.92 v25.4,11.18 | U5.13 22.19,33.75 v23.24,34.8 | v27.43,35.81 27.81,35.81 28.19,35.43 28.19,30.99 | v28.19,14.22 28.19,30.99 | J5.4 40.64,9.4 42.16,10.92 | 44.7,19.18 45.72,18.16 v45.72,13.34 | 44.96,10.92 v45.72,11.68 | 40.01,29.46 38.23,29.46 37.72,28.96 37.72,14.73 v36.32,13.34 35.05,14.61 v35.05,17.02 | 33.91,10.92 v34.54,11.56 | U1.3 29.86,32.66 28.19,30.99 | v26.29,16.89 24.51,18.67
  Bottom 0.406: v25.4,11.18 28.19,13.97 v28.19,14.22 28.19,14.99 v26.29,16.89 | v23.24,34.8 26.42,34.8 v27.43,35.81 | v45.72,11.68 v45.72,13.34 | v34.54,11.56 v36.32,13.34 | v35.05,17.02 v35.05,20.83
SS  (via drill 0.6)
  Top 0.254: v62.61,40.26 59.99,40.26 U12.CS | J4.5 63.5,23.62 J3.5
  Bottom 0.254: J4.5 64.77,26.67 64.77,38.1 v62.61,40.26
VCC
  Top 0.406: C19.1 10.55,24.88 U8.3 | C3.1 4.56,24.75 U7.3
  Top 0.813: J8.1 7.87,22.73 | 7.87,22.73 10.03,24.89 U8.3 | 7.87,22.73 5.33,25.27 U7.3
  Top 1.016: JP2.6 43.94,4.32 23.24,4.32 J8.1
VCC3V3  (via drill 0.38)
  Top 0.203: U4.5 41.67,18.18 43.17,19.68 U4.10 | v36.58,22.48 U3.P$8 | 31.88,22.86 32.86,22.86 U3.P$2
  Top 0.254: 21.09,25.12 U2.P$1 | C6.2 19.86,23.89 | 23.87,25.28 U2.P$14 | U1.1 31.16,36.45 | 31.16,36.45 31.16,37.01 C13.1 C14.2 | U1.14 32.26,35.35 31.16,36.45 | U6.13 42.66,29.09 42.16,29.59 42.16,30.47 C16.1 v41.02,30.48 | U6.4 40.53,26.29 39.75,26.29 39.5,26.54 | 39.5,26.54 39.5,26.92 39.87,27.3 U6.2 | C4.2 C5.2 36.96,20.94 36.96,22.1 v36.58,22.48 | U4.2 U4.10 43.7,19.68 43.69,19.68 45.47,19.68 48.01,22.23 | C9.1 41.12,17.04 U4.5 | v39.5,23.62 39.5,26.54
  Top 0.305: C10.1 17.1,33.75 U5.1 19.98,35.48 | 21.72,37.21 22.63,37.21 C11.+ 23.24,37.82 23.24,37.97 27.43,37.97 28.45,36.96 | 23.43,32.95 U5.12 22.24,32.89 23.37,32.89 | 19.94,28.96 19.94,29.71 U5.6 | C8.1 20.95,26.55 | v31.62,23.75 31.62,23.11 31.88,22.86
  Top 0.406: 21.72,37.21 19.98,35.48 | C11.+ 24.38,35.96 24.38,33.91 23.43,32.95 | 23.37,32.89 24.38,31.88 24.38,28.96 23.11,27.69 20.95,27.69 | 20.95,26.55 20.95,27.69 | 19.86,23.89 21.09,25.12 C8.1 22.73,26.42 23.87,25.28 | 21.45,10.55 R2.2 R1.2 | U1.1 31.15,34.26 28.45,36.96 | v57.02,12.95 57.15,13.08 | 20.95,27.69 19.94,28.7 19.94,28.96
  Top 0.508: 21.45,10.55 23.11,8.89 33.91,8.89 J5.2 36.96,5.84 48.01,5.84 48.64,6.48 50.55,6.48 v54.1,10.03 | U12.VCC 58.22,38.02 57.15,36.96 57.15,19.94 | 57.15,13.08 57.15,19.94 | 57.15,19.94 54.86,22.23 48.01,22.23 v40.89,22.23 v39.5,23.62
  Top 0.813: R1.2 21.45,13.6 16.13,18.92 16.13,22.73 17.27,23.88 19.29,23.88 C6.2
  Bottom 0.254: v39.5,23.62 39.5,28.96 v41.02,30.48
  Bottom 0.305: v36.58,22.48 34.8,24.26 32.13,24.26 v31.62,23.75
  Bottom 0.406: v36.58,22.48 36.83,22.23 v40.89,22.23
  Bottom 0.508: v54.1,10.03 v57.02,12.95
  Bottom 0.813: J5.2 JP2.2